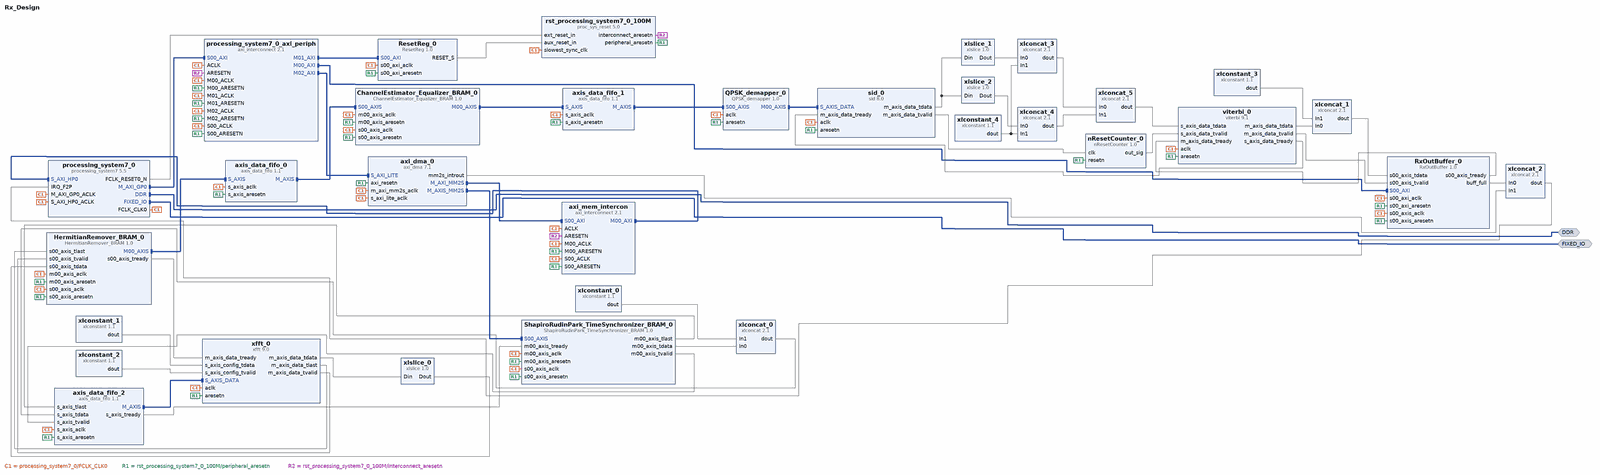
[diagram p0: block diagram of the top level, whole]
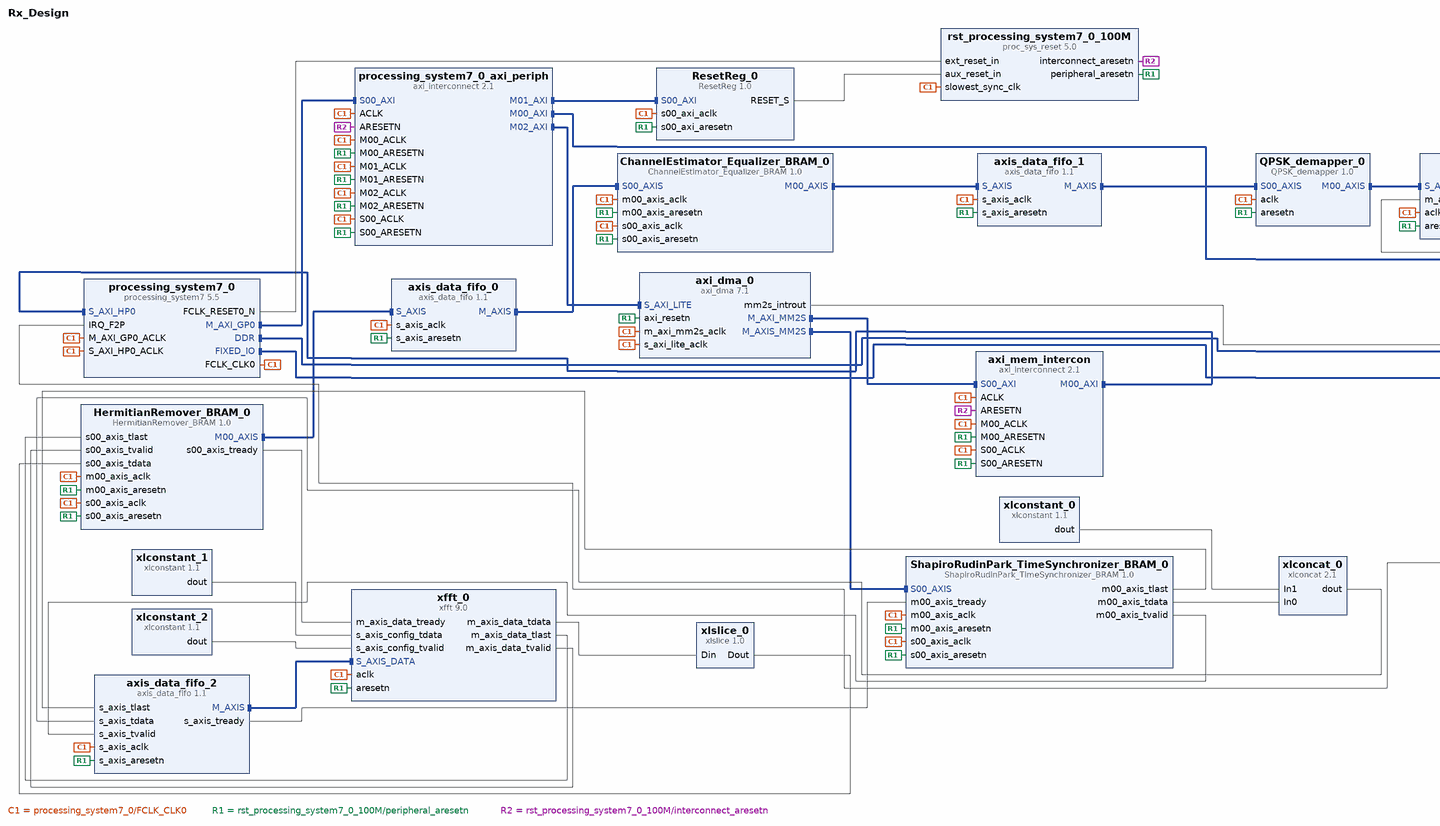
[diagram p1: block diagram of the top level, left part]
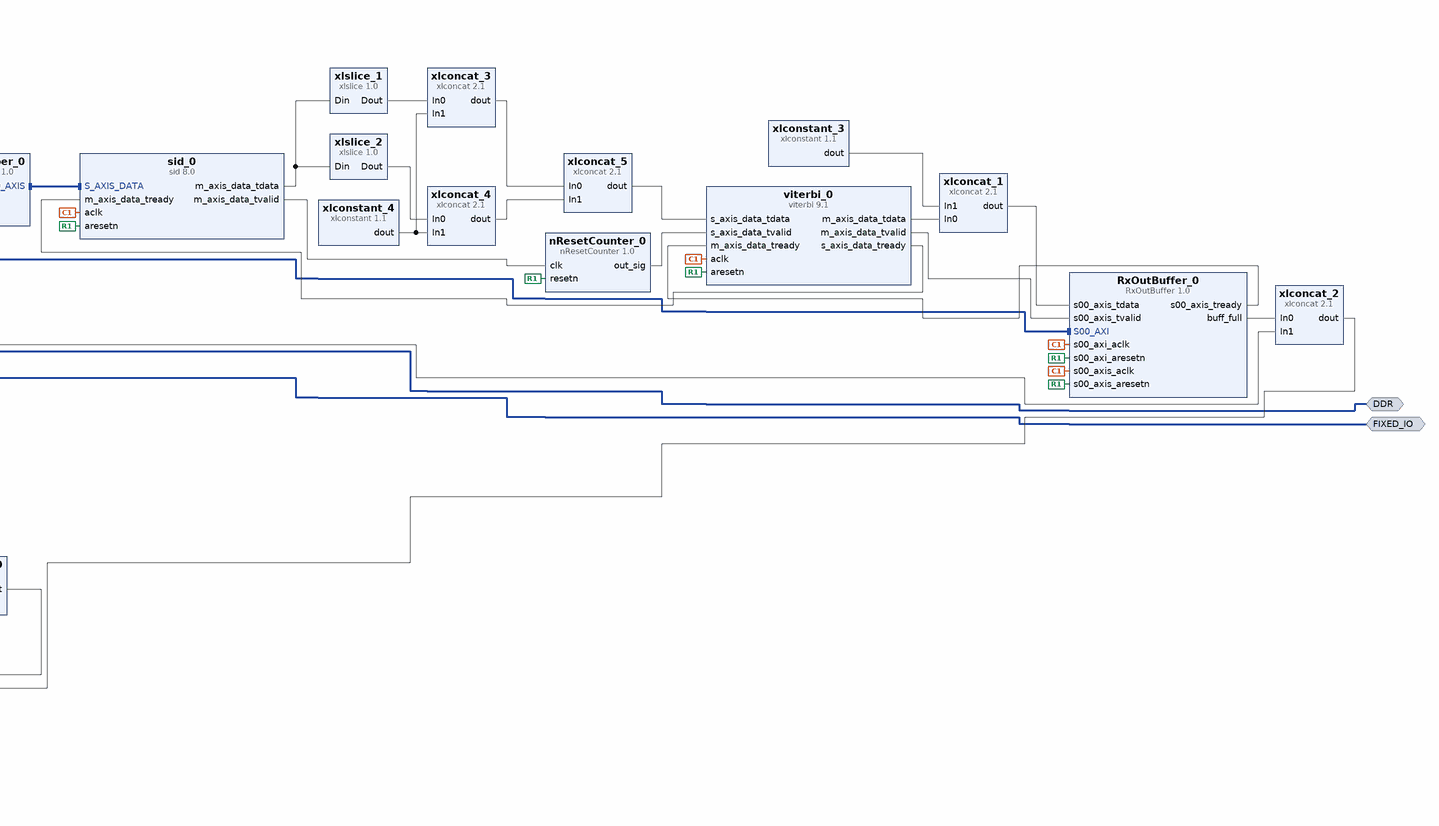
[diagram p2: block diagram of the top level, right part]
# Vivado block design Rx_Design, Vivado 2016.2
create_bd_design Rx_Design

create_bd_intf_port -mode Master -vlnv xilinx.com:interface:ddrx_rtl:1.0 DDR
create_bd_intf_port -mode Master -vlnv xilinx.com:display_processing_system7:fixedio_rtl:1.0 FIXED_IO

create_bd_cell -type ip -vlnv xilinx.com:ip:processing_system7:5.5 processing_system7_0
set_property -dict [list \
  CONFIG.PCW_FCLK_CLK0_BUF true \
  CONFIG.PCW_UIPARAM_DDR_FREQ_MHZ 525 \
  CONFIG.PCW_CRYSTAL_PERIPHERAL_FREQMHZ 50 \
  CONFIG.PCW_APU_PERIPHERAL_FREQMHZ 650 \
  CONFIG.PCW_UART_PERIPHERAL_FREQMHZ 100 \
  CONFIG.PCW_FPGA0_PERIPHERAL_FREQMHZ 100 \
  CONFIG.PCW_FPGA1_PERIPHERAL_FREQMHZ 50 \
  CONFIG.PCW_USE_S_AXI_HP0 1 \
  CONFIG.PCW_M_AXI_GP0_FREQMHZ 10 \
  CONFIG.PCW_S_AXI_HP0_FREQMHZ 10 \
  CONFIG.PCW_USE_FABRIC_INTERRUPT 1 \
  CONFIG.PCW_IRQ_F2P_INTR 1 \
  CONFIG.PCW_PERIPHERAL_BOARD_PRESET part0 \
  CONFIG.PCW_PRESET_BANK1_VOLTAGE {LVCMOS 1.8V} \
  CONFIG.PCW_UIPARAM_DDR_BUS_WIDTH {16 Bit} \
  CONFIG.PCW_UIPARAM_DDR_PARTNO {MT41J256M16 RE-125} \
  CONFIG.PCW_QSPI_PERIPHERAL_ENABLE 1 \
  CONFIG.PCW_QSPI_QSPI_IO {MIO 1 .. 6} \
  CONFIG.PCW_QSPI_GRP_SINGLE_SS_ENABLE 1 \
  CONFIG.PCW_QSPI_GRP_SINGLE_SS_IO {MIO 1 .. 6} \
  CONFIG.PCW_QSPI_GRP_FBCLK_ENABLE 1 \
  CONFIG.PCW_QSPI_GRP_FBCLK_IO {MIO 8} \
  CONFIG.PCW_ENET0_PERIPHERAL_ENABLE 1 \
  CONFIG.PCW_ENET0_ENET0_IO {MIO 16 .. 27} \
  CONFIG.PCW_ENET0_GRP_MDIO_ENABLE 1 \
  CONFIG.PCW_ENET0_GRP_MDIO_IO {MIO 52 .. 53} \
  CONFIG.PCW_SD0_PERIPHERAL_ENABLE 0 \
  CONFIG.PCW_UART0_PERIPHERAL_ENABLE 1 \
  CONFIG.PCW_UART0_UART0_IO {MIO 14 .. 15} \
  CONFIG.PCW_UART1_PERIPHERAL_ENABLE 0 \
  CONFIG.PCW_USB0_PERIPHERAL_ENABLE 0 \
  CONFIG.PCW_GPIO_MIO_GPIO_ENABLE 0 \
] [get_bd_cells processing_system7_0]
# 392 more settings of processing_system7_0 are not shown: defaults, MIO pin electricals, DDR timing, and values the tool derives
create_bd_cell -type ip -vlnv xilinx.com:ip:xfft:9.0 xfft_0
set_property -dict [list \
  CONFIG.transform_length 64 \
  CONFIG.implementation_options automatically_select \
  CONFIG.data_format fixed_point \
  CONFIG.input_width 8 \
  CONFIG.scaling_options unscaled \
  CONFIG.rounding_modes convergent_rounding \
  CONFIG.aresetn true \
  CONFIG.output_ordering natural_order \
  CONFIG.cyclic_prefix_insertion false \
  CONFIG.number_of_stages_using_block_ram_for_data_and_phase_factors 0 \
  CONFIG.complex_mult_type use_mults_performance \
  CONFIG.butterfly_type use_xtremedsp_slices \
] [get_bd_cells xfft_0]
create_bd_cell -type ip -vlnv xilinx.com:ip:sid:8.0 sid_0
set_property -dict [list \
  CONFIG.symbol_width 2 \
  CONFIG.sid_type rectangular \
  CONFIG.mode deinterleaver \
  CONFIG.number_of_branches 16 \
  CONFIG.number_of_rows_constant_value 28 \
  CONFIG.block_size_type constant \
  CONFIG.minimum_rows 15 \
  CONFIG.number_of_columns_constant_value 8 \
  CONFIG.col_port_width 4 \
  CONFIG.minimum_columns 15 \
  CONFIG.block_size_constant_value 224 \
  CONFIG.block_size_port_width 8 \
  CONFIG.HAS_ARESETN true \
  CONFIG.HAS_DOUT_TREADY true \
] [get_bd_cells sid_0]
create_bd_cell -type ip -vlnv xilinx.com:ip:viterbi:9.1 viterbi_0
set_property -dict [list \
  CONFIG.Coding Hard_Coding \
  CONFIG.Soft_Width 1 \
  CONFIG.Convolution_Code_0_Radix Binary \
  CONFIG.Convolution0_Code0 1011011 \
  CONFIG.Convolution0_Code1 1111001 \
  CONFIG.BER_Symbol_Count false \
] [get_bd_cells viterbi_0]
create_bd_cell -type ip -vlnv xilinx.com:user:RxOutBuffer:1.0 RxOutBuffer_0
create_bd_cell -type ip -vlnv xilinx.com:ip:axi_interconnect:2.1 processing_system7_0_axi_periph
set_property -dict {CONFIG.NUM_MI 3} [get_bd_cells processing_system7_0_axi_periph]
create_bd_cell -type ip -vlnv xilinx.com:ip:proc_sys_reset:5.0 rst_processing_system7_0_100M
set_property -dict {CONFIG.C_AUX_RESET_HIGH 0 CONFIG.C_AUX_RST_WIDTH 1} [get_bd_cells rst_processing_system7_0_100M]
create_bd_cell -type ip -vlnv xilinx.com:user:ResetReg:1.0 ResetReg_0
create_bd_cell -type ip -vlnv xilinx.com:ip:xlconcat:2.1 xlconcat_0
set_property -dict {CONFIG.IN0_WIDTH 8 CONFIG.IN1_WIDTH 8} [get_bd_cells xlconcat_0]
create_bd_cell -type ip -vlnv xilinx.com:ip:xlconstant:1.1 xlconstant_0
set_property -dict {CONFIG.CONST_WIDTH 8 CONFIG.CONST_VAL 0} [get_bd_cells xlconstant_0]
create_bd_cell -type ip -vlnv xilinx.com:ip:xlconstant:1.1 xlconstant_1
set_property -dict {CONFIG.CONST_WIDTH 8 CONFIG.CONST_VAL 1} [get_bd_cells xlconstant_1]
create_bd_cell -type ip -vlnv xilinx.com:ip:xlconstant:1.1 xlconstant_2
create_bd_cell -type ip -vlnv xilinx.com:ip:xlslice:1.0 xlslice_0
set_property -dict {CONFIG.DOUT_WIDTH 16 CONFIG.DIN_FROM 15} [get_bd_cells xlslice_0]
create_bd_cell -type ip -vlnv xilinx.com:ip:xlconcat:2.1 xlconcat_1
set_property -dict {CONFIG.IN0_WIDTH 8 CONFIG.IN1_WIDTH 24} [get_bd_cells xlconcat_1]
create_bd_cell -type ip -vlnv xilinx.com:ip:xlconstant:1.1 xlconstant_3
set_property -dict {CONFIG.CONST_WIDTH 24 CONFIG.CONST_VAL 0} [get_bd_cells xlconstant_3]
create_bd_cell -type ip -vlnv xilinx.com:ip:axi_dma:7.1 axi_dma_0
set_property -dict {CONFIG.c_include_sg 0 CONFIG.c_m_axis_mm2s_tdata_width 8 CONFIG.c_include_s2mm 0} [get_bd_cells axi_dma_0]
create_bd_cell -type ip -vlnv xilinx.com:ip:axi_interconnect:2.1 axi_mem_intercon
set_property -dict {CONFIG.NUM_MI 1} [get_bd_cells axi_mem_intercon]
create_bd_cell -type ip -vlnv xilinx.com:ip:xlconcat:2.1 xlconcat_2
create_bd_cell -type ip -vlnv xilinx.com:ip:xlslice:1.0 xlslice_1
set_property -dict {CONFIG.DIN_TO 0 CONFIG.DIN_FROM 0 CONFIG.DIN_WIDTH 8} [get_bd_cells xlslice_1]
create_bd_cell -type ip -vlnv xilinx.com:ip:xlslice:1.0 xlslice_2
set_property -dict {CONFIG.DOUT_WIDTH 1 CONFIG.DIN_TO 1 CONFIG.DIN_FROM 1 CONFIG.DIN_WIDTH 8} [get_bd_cells xlslice_2]
create_bd_cell -type ip -vlnv xilinx.com:ip:xlconcat:2.1 xlconcat_3
set_property -dict {CONFIG.IN0_WIDTH 1 CONFIG.IN1_WIDTH 7} [get_bd_cells xlconcat_3]
create_bd_cell -type ip -vlnv xilinx.com:ip:xlconcat:2.1 xlconcat_4
set_property -dict {CONFIG.IN0_WIDTH 1 CONFIG.IN1_WIDTH 7} [get_bd_cells xlconcat_4]
create_bd_cell -type ip -vlnv xilinx.com:ip:xlconcat:2.1 xlconcat_5
set_property -dict {CONFIG.IN0_WIDTH 8 CONFIG.IN1_WIDTH 8} [get_bd_cells xlconcat_5]
create_bd_cell -type ip -vlnv xilinx.com:ip:xlconstant:1.1 xlconstant_4
set_property -dict {CONFIG.CONST_WIDTH 7 CONFIG.CONST_VAL 0} [get_bd_cells xlconstant_4]
create_bd_cell -type ip -vlnv xilinx.com:user:nResetCounter:1.0 nResetCounter_0
create_bd_cell -type ip -vlnv xilinx.com:ip:axis_data_fifo:1.1 axis_data_fifo_0
set_property -dict {CONFIG.TDATA_NUM_BYTES 2 CONFIG.FIFO_DEPTH 512 CONFIG.HAS_TLAST 1} [get_bd_cells axis_data_fifo_0]
create_bd_cell -type ip -vlnv xilinx.com:ip:axis_data_fifo:1.1 axis_data_fifo_1
set_property -dict {CONFIG.TDATA_NUM_BYTES 2 CONFIG.FIFO_DEPTH 256 CONFIG.HAS_TLAST 1} [get_bd_cells axis_data_fifo_1]
create_bd_cell -type ip -vlnv xilinx.com:user:QPSK_demapper:1.0 QPSK_demapper_0
create_bd_cell -type ip -vlnv xilinx.com:ip:axis_data_fifo:1.1 axis_data_fifo_2
set_property -dict {CONFIG.TDATA_NUM_BYTES 2 CONFIG.FIFO_DEPTH 1024 CONFIG.HAS_TLAST 1} [get_bd_cells axis_data_fifo_2]
create_bd_cell -type ip -vlnv xilinx.com:user:HermitianRemover_BRAM:1.0 HermitianRemover_BRAM_0
create_bd_cell -type ip -vlnv xilinx.com:user:ChannelEstimator_Equalizer_BRAM:1.0 ChannelEstimator_Equalizer_BRAM_0
create_bd_cell -type ip -vlnv xilinx.com:user:ShapiroRudinPark_TimeSynchronizer_BRAM:1.0 ShapiroRudinPark_TimeSynchronizer_BRAM_0

# ---- connections ----

connect_bd_intf_net [get_bd_intf_pins processing_system7_0/M_AXI_GP0] [get_bd_intf_pins processing_system7_0_axi_periph/S00_AXI]
connect_bd_intf_net [get_bd_intf_pins processing_system7_0_axi_periph/M00_AXI] [get_bd_intf_pins RxOutBuffer_0/S00_AXI]
connect_bd_intf_net [get_bd_intf_pins processing_system7_0_axi_periph/M01_AXI] [get_bd_intf_pins ResetReg_0/S00_AXI]
connect_bd_intf_net [get_bd_intf_pins axi_mem_intercon/M00_AXI] [get_bd_intf_pins processing_system7_0/S_AXI_HP0]
connect_bd_intf_net [get_bd_intf_pins processing_system7_0_axi_periph/M02_AXI] [get_bd_intf_pins axi_dma_0/S_AXI_LITE]
connect_bd_intf_net [get_bd_intf_pins axi_dma_0/M_AXI_MM2S] [get_bd_intf_pins axi_mem_intercon/S00_AXI]
connect_bd_intf_net [get_bd_intf_pins axis_data_fifo_1/M_AXIS] [get_bd_intf_pins QPSK_demapper_0/S00_AXIS]
connect_bd_intf_net [get_bd_intf_pins QPSK_demapper_0/M00_AXIS] [get_bd_intf_pins sid_0/S_AXIS_DATA]
connect_bd_intf_net [get_bd_intf_pins axis_data_fifo_2/M_AXIS] [get_bd_intf_pins xfft_0/S_AXIS_DATA]
connect_bd_intf_net [get_bd_intf_pins HermitianRemover_BRAM_0/M00_AXIS] [get_bd_intf_pins axis_data_fifo_0/S_AXIS]
connect_bd_intf_net [get_bd_intf_pins axis_data_fifo_0/M_AXIS] [get_bd_intf_pins ChannelEstimator_Equalizer_BRAM_0/S00_AXIS]
connect_bd_intf_net [get_bd_intf_pins ChannelEstimator_Equalizer_BRAM_0/M00_AXIS] [get_bd_intf_pins axis_data_fifo_1/S_AXIS]
connect_bd_intf_net [get_bd_intf_pins axi_dma_0/M_AXIS_MM2S] [get_bd_intf_pins ShapiroRudinPark_TimeSynchronizer_BRAM_0/S00_AXIS]
connect_bd_intf_net [get_bd_intf_ports DDR] [get_bd_intf_pins processing_system7_0/DDR]
connect_bd_intf_net [get_bd_intf_ports FIXED_IO] [get_bd_intf_pins processing_system7_0/FIXED_IO]
connect_bd_net [get_bd_pins processing_system7_0/FCLK_CLK0] \
  [get_bd_pins processing_system7_0/M_AXI_GP0_ACLK] [get_bd_pins rst_processing_system7_0_100M/slowest_sync_clk] \
  [get_bd_pins RxOutBuffer_0/s00_axi_aclk] [get_bd_pins ResetReg_0/s00_axi_aclk] [get_bd_pins xfft_0/aclk] \
  [get_bd_pins sid_0/aclk] [get_bd_pins viterbi_0/aclk] [get_bd_pins RxOutBuffer_0/s00_axis_aclk] \
  [get_bd_pins processing_system7_0/S_AXI_HP0_ACLK] [get_bd_pins axi_dma_0/s_axi_lite_aclk] \
  [get_bd_pins axi_dma_0/m_axi_mm2s_aclk] [get_bd_pins axis_data_fifo_0/s_axis_aclk] \
  [get_bd_pins axis_data_fifo_1/s_axis_aclk] [get_bd_pins QPSK_demapper_0/aclk] [get_bd_pins axis_data_fifo_2/s_axis_aclk] \
  [get_bd_pins processing_system7_0_axi_periph/S00_ACLK] [get_bd_pins processing_system7_0_axi_periph/ACLK] \
  [get_bd_pins processing_system7_0_axi_periph/M00_ACLK] [get_bd_pins processing_system7_0_axi_periph/M01_ACLK] \
  [get_bd_pins axi_mem_intercon/S00_ACLK] [get_bd_pins axi_mem_intercon/ACLK] [get_bd_pins axi_mem_intercon/M00_ACLK] \
  [get_bd_pins processing_system7_0_axi_periph/M02_ACLK] [get_bd_pins HermitianRemover_BRAM_0/s00_axis_aclk] \
  [get_bd_pins HermitianRemover_BRAM_0/m00_axis_aclk] [get_bd_pins ChannelEstimator_Equalizer_BRAM_0/m00_axis_aclk] \
  [get_bd_pins ChannelEstimator_Equalizer_BRAM_0/s00_axis_aclk] \
  [get_bd_pins ShapiroRudinPark_TimeSynchronizer_BRAM_0/m00_axis_aclk] \
  [get_bd_pins ShapiroRudinPark_TimeSynchronizer_BRAM_0/s00_axis_aclk]
connect_bd_net [get_bd_pins processing_system7_0/FCLK_RESET0_N] [get_bd_pins rst_processing_system7_0_100M/ext_reset_in]
connect_bd_net [get_bd_pins rst_processing_system7_0_100M/peripheral_aresetn] \
  [get_bd_pins RxOutBuffer_0/s00_axi_aresetn] [get_bd_pins ResetReg_0/s00_axi_aresetn] [get_bd_pins viterbi_0/aresetn] \
  [get_bd_pins RxOutBuffer_0/s00_axis_aresetn] [get_bd_pins axi_dma_0/axi_resetn] [get_bd_pins nResetCounter_0/resetn] \
  [get_bd_pins sid_0/aresetn] [get_bd_pins axis_data_fifo_0/s_axis_aresetn] [get_bd_pins axis_data_fifo_1/s_axis_aresetn] \
  [get_bd_pins QPSK_demapper_0/aresetn] [get_bd_pins axis_data_fifo_2/s_axis_aresetn] [get_bd_pins xfft_0/aresetn] \
  [get_bd_pins processing_system7_0_axi_periph/S00_ARESETN] [get_bd_pins processing_system7_0_axi_periph/M00_ARESETN] \
  [get_bd_pins processing_system7_0_axi_periph/M01_ARESETN] [get_bd_pins axi_mem_intercon/S00_ARESETN] \
  [get_bd_pins axi_mem_intercon/M00_ARESETN] [get_bd_pins processing_system7_0_axi_periph/M02_ARESETN] \
  [get_bd_pins HermitianRemover_BRAM_0/s00_axis_aresetn] [get_bd_pins HermitianRemover_BRAM_0/m00_axis_aresetn] \
  [get_bd_pins ChannelEstimator_Equalizer_BRAM_0/m00_axis_aresetn] \
  [get_bd_pins ChannelEstimator_Equalizer_BRAM_0/s00_axis_aresetn] \
  [get_bd_pins ShapiroRudinPark_TimeSynchronizer_BRAM_0/m00_axis_aresetn] \
  [get_bd_pins ShapiroRudinPark_TimeSynchronizer_BRAM_0/s00_axis_aresetn]
connect_bd_net [get_bd_pins rst_processing_system7_0_100M/interconnect_aresetn] \
  [get_bd_pins processing_system7_0_axi_periph/ARESETN] [get_bd_pins axi_mem_intercon/ARESETN]
connect_bd_net [get_bd_pins xlconstant_0/dout] [get_bd_pins xlconcat_0/In1]
connect_bd_net [get_bd_pins xlconstant_1/dout] [get_bd_pins xfft_0/s_axis_config_tdata]
connect_bd_net [get_bd_pins xlconstant_2/dout] [get_bd_pins xfft_0/s_axis_config_tvalid]
connect_bd_net [get_bd_pins xfft_0/m_axis_data_tdata] [get_bd_pins xlslice_0/Din]
connect_bd_net [get_bd_pins viterbi_0/m_axis_data_tdata] [get_bd_pins xlconcat_1/In0]
connect_bd_net [get_bd_pins xlconstant_3/dout] [get_bd_pins xlconcat_1/In1]
connect_bd_net [get_bd_pins xlconcat_1/dout] [get_bd_pins RxOutBuffer_0/s00_axis_tdata]
connect_bd_net [get_bd_pins RxOutBuffer_0/s00_axis_tready] [get_bd_pins viterbi_0/m_axis_data_tready]
connect_bd_net [get_bd_pins viterbi_0/m_axis_data_tvalid] [get_bd_pins RxOutBuffer_0/s00_axis_tvalid]
connect_bd_net [get_bd_pins ResetReg_0/RESET_S] [get_bd_pins rst_processing_system7_0_100M/aux_reset_in]
connect_bd_net [get_bd_pins axi_dma_0/mm2s_introut] [get_bd_pins xlconcat_2/In1]
connect_bd_net [get_bd_pins RxOutBuffer_0/buff_full] [get_bd_pins xlconcat_2/In0]
connect_bd_net [get_bd_pins xlconcat_2/dout] [get_bd_pins processing_system7_0/IRQ_F2P]
connect_bd_net [get_bd_pins sid_0/m_axis_data_tdata] [get_bd_pins xlslice_2/Din] [get_bd_pins xlslice_1/Din]
connect_bd_net [get_bd_pins xlslice_1/Dout] [get_bd_pins xlconcat_3/In0]
connect_bd_net [get_bd_pins xlslice_2/Dout] [get_bd_pins xlconcat_4/In0]
connect_bd_net [get_bd_pins xlconstant_4/dout] [get_bd_pins xlconcat_3/In1] [get_bd_pins xlconcat_4/In1]
connect_bd_net [get_bd_pins xlconcat_3/dout] [get_bd_pins xlconcat_5/In0]
connect_bd_net [get_bd_pins xlconcat_4/dout] [get_bd_pins xlconcat_5/In1]
connect_bd_net [get_bd_pins xlconcat_5/dout] [get_bd_pins viterbi_0/s_axis_data_tdata]
connect_bd_net [get_bd_pins viterbi_0/s_axis_data_tready] [get_bd_pins sid_0/m_axis_data_tready]
connect_bd_net [get_bd_pins sid_0/m_axis_data_tvalid] [get_bd_pins nResetCounter_0/clk]
connect_bd_net [get_bd_pins nResetCounter_0/out_sig] [get_bd_pins viterbi_0/s_axis_data_tvalid]
connect_bd_net [get_bd_pins xlconcat_0/dout] [get_bd_pins axis_data_fifo_2/s_axis_tdata]
connect_bd_net [get_bd_pins xlslice_0/Dout] [get_bd_pins HermitianRemover_BRAM_0/s00_axis_tdata]
connect_bd_net [get_bd_pins xfft_0/m_axis_data_tlast] [get_bd_pins HermitianRemover_BRAM_0/s00_axis_tlast]
connect_bd_net [get_bd_pins HermitianRemover_BRAM_0/s00_axis_tready] [get_bd_pins xfft_0/m_axis_data_tready]
connect_bd_net [get_bd_pins xfft_0/m_axis_data_tvalid] [get_bd_pins HermitianRemover_BRAM_0/s00_axis_tvalid]
connect_bd_net [get_bd_pins ShapiroRudinPark_TimeSynchronizer_BRAM_0/m00_axis_tdata] [get_bd_pins xlconcat_0/In0]
connect_bd_net [get_bd_pins ShapiroRudinPark_TimeSynchronizer_BRAM_0/m00_axis_tlast] [get_bd_pins axis_data_fifo_2/s_axis_tlast]
connect_bd_net [get_bd_pins ShapiroRudinPark_TimeSynchronizer_BRAM_0/m00_axis_tvalid] [get_bd_pins axis_data_fifo_2/s_axis_tvalid]
connect_bd_net [get_bd_pins axis_data_fifo_2/s_axis_tready] [get_bd_pins ShapiroRudinPark_TimeSynchronizer_BRAM_0/m00_axis_tready]

# ---- address map ----
assign_bd_address -offset 0x00000000 -range 512M -target_address_space [get_bd_addr_spaces axi_dma_0/Data_MM2S] [get_bd_addr_segs processing_system7_0/S_AXI_HP0/HP0_DDR_LOWOCM]
assign_bd_address -offset 0x40400000 -range 64K -target_address_space [get_bd_addr_spaces processing_system7_0/Data] [get_bd_addr_segs axi_dma_0/S_AXI_LITE/Reg]
assign_bd_address -offset 0x43C00000 -range 64K -target_address_space [get_bd_addr_spaces processing_system7_0/Data] [get_bd_addr_segs RxOutBuffer_0/S00_AXI/S00_AXI_reg]
assign_bd_address -offset 0x43C10000 -range 64K -target_address_space [get_bd_addr_spaces processing_system7_0/Data] [get_bd_addr_segs ResetReg_0/S00_AXI/S00_AXI_reg]

validate_bd_design
save_bd_design
